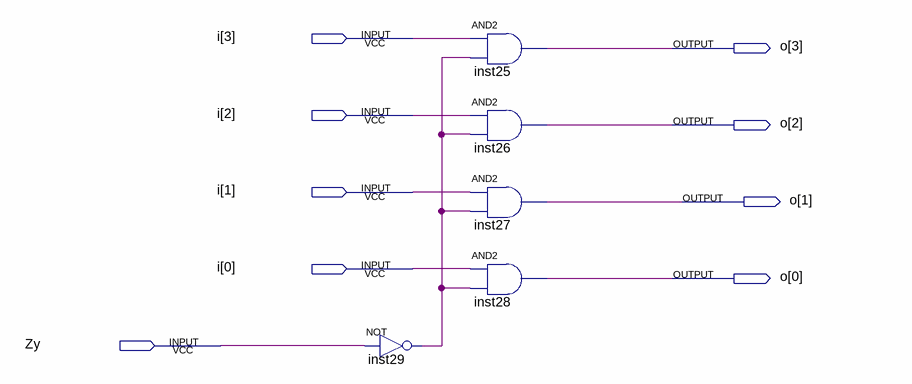
[diagram p0: schematic sheet]
// Quartus schematic Zera.bdf as structural Verilog: 5 symbols, 9 pins
module Zera (
  input  [3:0] i,
  input  Zy,
  output [3:0] o
);

  wire inst29_out;

  not inst29 (inst29_out, Zy);
  and inst25 (o[3], i[3], inst29_out);
  and inst26 (o[2], i[2], inst29_out);
  and inst27 (o[1], i[1], inst29_out);
  and inst28 (o[0], i[0], inst29_out);
endmodule
